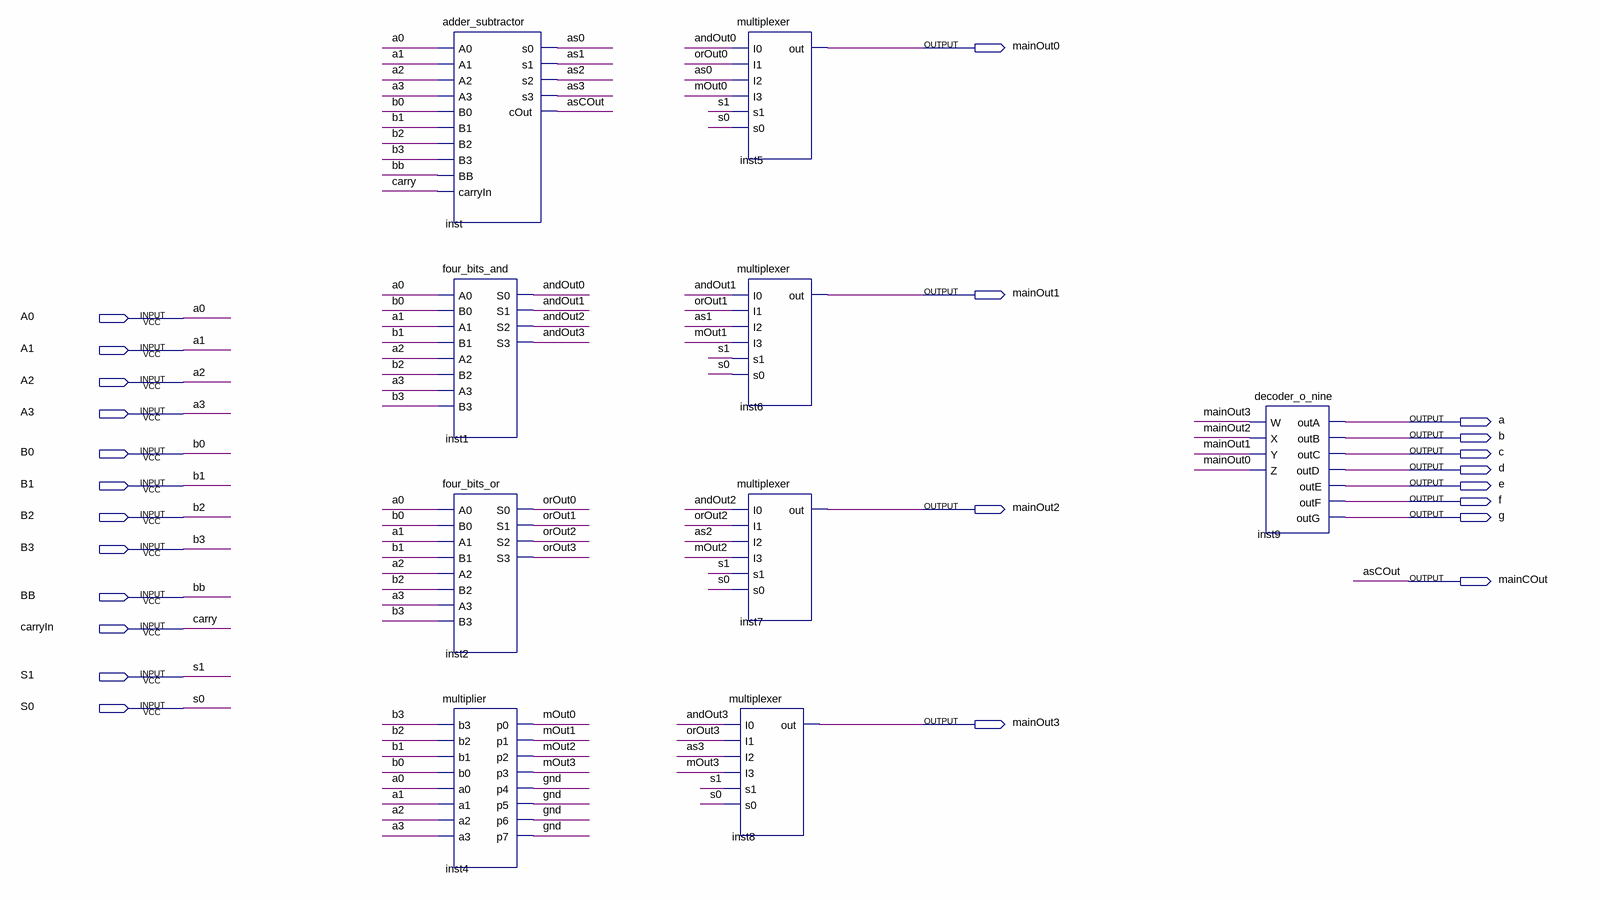
[diagram p0: schematic sheet]
// Quartus schematic alu.bdf as structural Verilog: 9 symbols, 24 pins
module alu (
  input  A0,
  input  A1,
  input  A2,
  input  A3,
  input  B0,
  input  B1,
  input  B2,
  input  B3,
  input  BB,
  input  carryIn,
  input  S1,
  input  S0,
  output mainOut0,
  output mainOut1,
  output a,
  output b,
  output c,
  output d,
  output e,
  output f,
  output mainOut2,
  output g,
  output mainCOut,
  output mainOut3
);

  wire andOut0, andOut1, andOut2, andOut3, as0, as1, as2, as3, gnd, mOut0, mOut1, mOut2, mOut3, orOut0,
       orOut1, orOut2, orOut3;

  adder_subtractor inst (
    .A0(A0), .A1(A1), .A2(A2), .A3(A3), .B0(B0), .B1(B1), .B2(B2), .B3(B3), .BB(BB), .carryIn(carryIn),
    .s0(as0), .s1(as1), .s2(as2), .s3(as3), .cOut(mainCOut));
  four_bits_and inst1 (
    .A0(A0), .B0(B0), .A1(A1), .B1(B1), .A2(A2), .B2(B2), .A3(A3), .B3(B3), .S0(andOut0), .S1(andOut1),
    .S2(andOut2), .S3(andOut3));
  four_bits_or inst2 (
    .A0(A0), .B0(B0), .A1(A1), .B1(B1), .A2(A2), .B2(B2), .A3(A3), .B3(B3), .S0(orOut0), .S1(orOut1),
    .S2(orOut2), .S3(orOut3));
  multiplier inst4 (
    .b3(B3), .b2(B2), .b1(B1), .b0(B0), .a0(A0), .a1(A1), .a2(A2), .a3(A3), .p0(mOut0), .p1(mOut1),
    .p2(mOut2), .p3(mOut3), .p4(gnd), .p5(gnd), .p6(gnd), .p7(gnd));
  multiplexer inst5 (.I0(andOut0), .I1(orOut0), .I2(as0), .I3(mOut0), .s1(S1), .s0(S0), .out(mainOut0));
  multiplexer inst6 (.I0(andOut1), .I1(orOut1), .I2(as1), .I3(mOut1), .s1(S1), .s0(S0), .out(mainOut1));
  multiplexer inst7 (.I0(andOut2), .I1(orOut2), .I2(as2), .I3(mOut2), .s1(S1), .s0(S0), .out(mainOut2));
  multiplexer inst8 (.I0(andOut3), .I1(orOut3), .I2(as3), .I3(mOut3), .s1(S1), .s0(S0), .out(mainOut3));
  decoder_o_nine inst9 (
    .W(mainOut3), .X(mainOut2), .Y(mainOut1), .Z(mainOut0), .outA(a), .outB(b), .outC(c), .outD(d), .outE(e),
    .outF(f), .outG(g));

  // Other names for the same wires on the sheet: asCOut = mainCOut; carry = carryIn
endmodule
